# EAGLE design Dual Vertical Breakout Module (EAGLE 6.1)
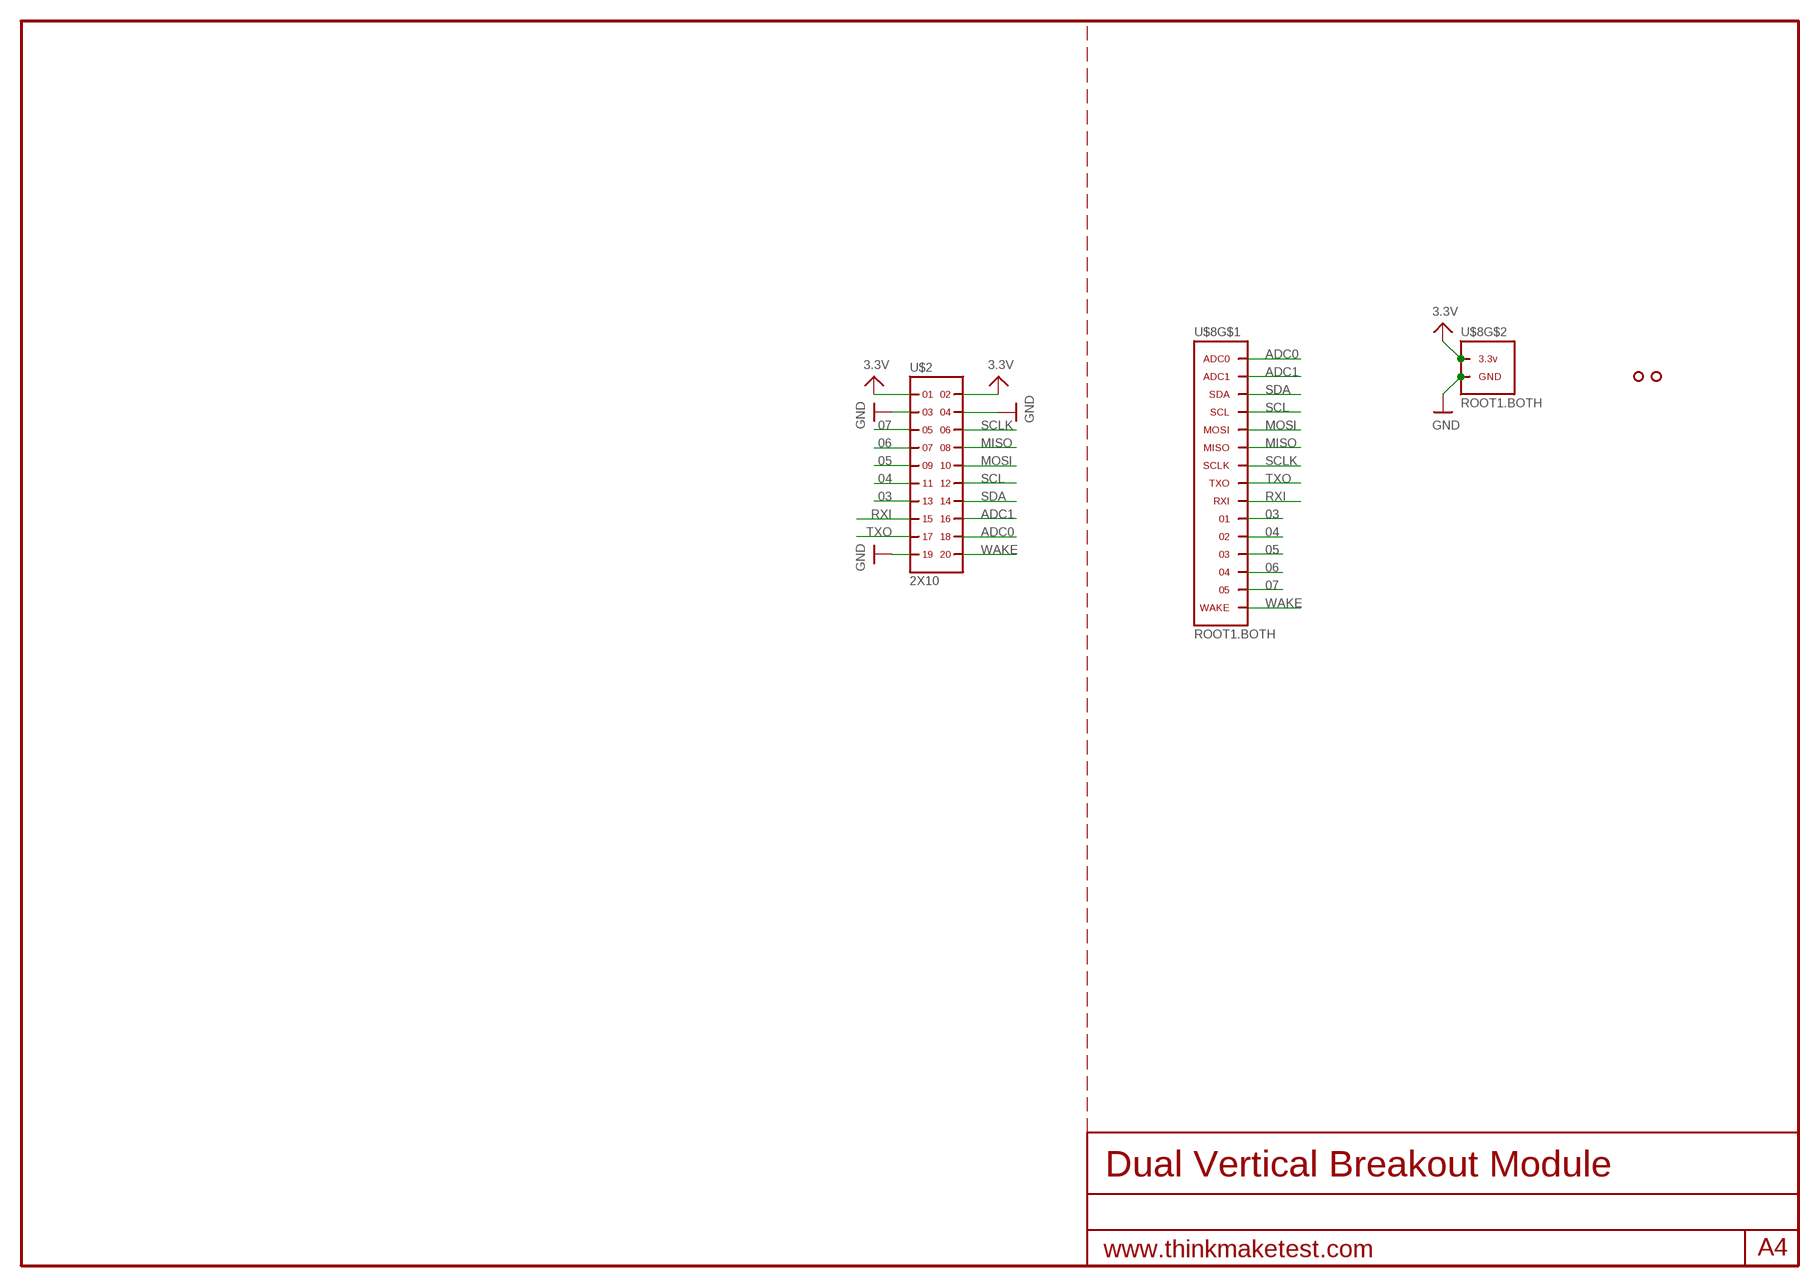
[diagram p0: schematic, sheet 1]

## Parts
U$2  2X10  [2X10]
U$3  HOLE.2MM  [2MM]
U$4  HOLE.2MM  [2MM]
U$8  ROOT1.BOTH  [ROOT1.BOTH]

## Nets
03: U$2.13 U$8.03 U$8.03@1 U$8.03@VIA
3.3V: U$2.1 U$2.2 U$8.3.3V@1(3.3V) U$8.3.3V@2(3.3V) U$8.3.3V@3(3.3V) U$8.3.3V@4(3.3V) U$8.3.3V@5(3.3V) U$8.3.3V@6(3.3V) U$8.3.3V@7(3.3V) U$8.3.3V@8(3.3V) U$8.3.3V@9(3.3V) U$8.3.3V@10(3.3V) U$8.3.3V@VIA(3.3V)
04: U$2.11 U$8.04 U$8.04@1 U$8.04@VIA
05: U$2.9 U$8.05 U$8.05@1 U$8.05@VIA
06: U$2.7 U$8.06 U$8.06@1 U$8.06@VIA
07: U$2.5 U$8.07 U$8.07@1 U$8.07@VIA
ADC0: U$2.18 U$8.ADC0 U$8.ADC0@1(ADC0) U$8.ADC0@VIA(ADC0)
ADC1: U$2.16 U$8.ADC1 U$8.ADC1@1(ADC1) U$8.ADC1@VIA(ADC1)
GND: U$2.3 U$2.4 U$2.19 U$8.GND@1(GND) U$8.GND@2(GND) U$8.GND@3(GND) U$8.GND@4(GND) U$8.GND@5(GND) U$8.GND@6(GND) U$8.GND@7(GND) U$8.GND@8(GND) U$8.GND@9(GND) U$8.GND@10(GND) U$8.GND@11(GND) U$8.GND@12(GND) U$8.GND@13(GND) U$8.GND@14(GND) U$8.GND@15(GND) U$8.GND@16(GND) U$8.GND@17(GND) U$8.GND@18(GND) U$8.GND@19(GND) U$8.GND@20(GND) U$8.GND@VIA(GND)
MISO: U$2.8 U$8.MISO U$8.MISO@1(MISO) U$8.MISO@VIA(MISO)
MOSI: U$2.10 U$8.MOSI U$8.MOSI@1(MOSI) U$8.MOSI@VIA(MOSI)
RXI: U$2.15 U$8.02(RXI) U$8.02@1(RXI) U$8.02@VIA(RXI)
SCL: U$2.12 U$8.SCL U$8.SCL@1(SCL) U$8.SCL@VIA(SCL)
SCLK: U$2.6 U$8.SCLK U$8.SCLK@1(SCLK) U$8.SCLK@VIA(SCLK)
SDA: U$2.14 U$8.SDA U$8.SDA@1(SDA) U$8.SDA@VIA(SDA)
TXO: U$2.17 U$8.01(TXO) U$8.01@1(TXO) U$8.01@VIA(TXO)
WAKE: U$2.20 U$8.WAKE U$8.WAKE@1(WAKE) U$8.WAKE@VIA(WAKE)

## Library data of the parts
U$2 = .headers(.1in):2X10
U$3 U$4 = .screw_holes:HOLE
U$8 = thinkmaketest:ROOT1

## Board
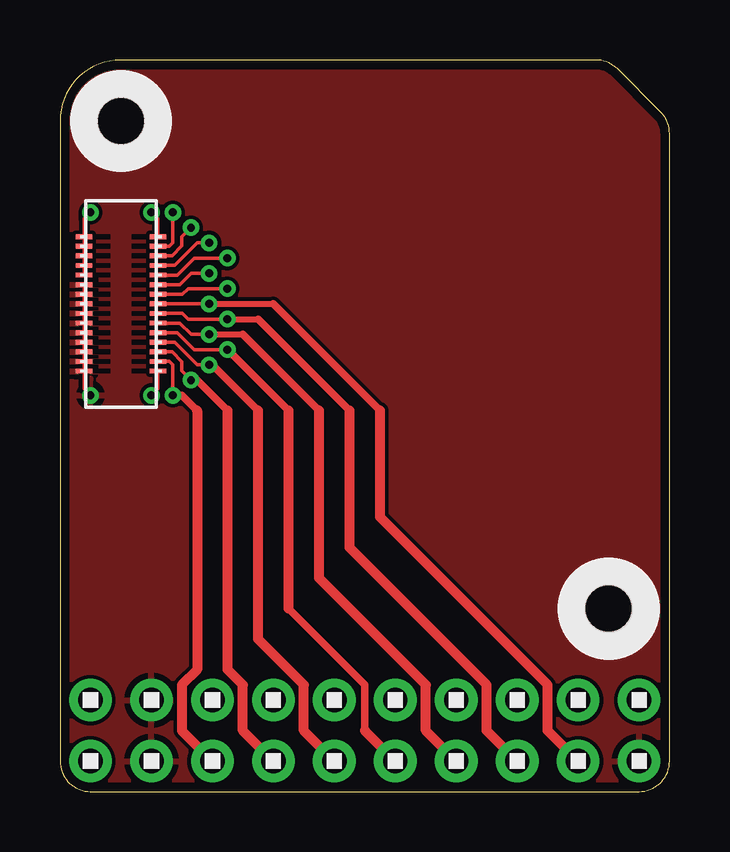
[diagram p1: board, top side]
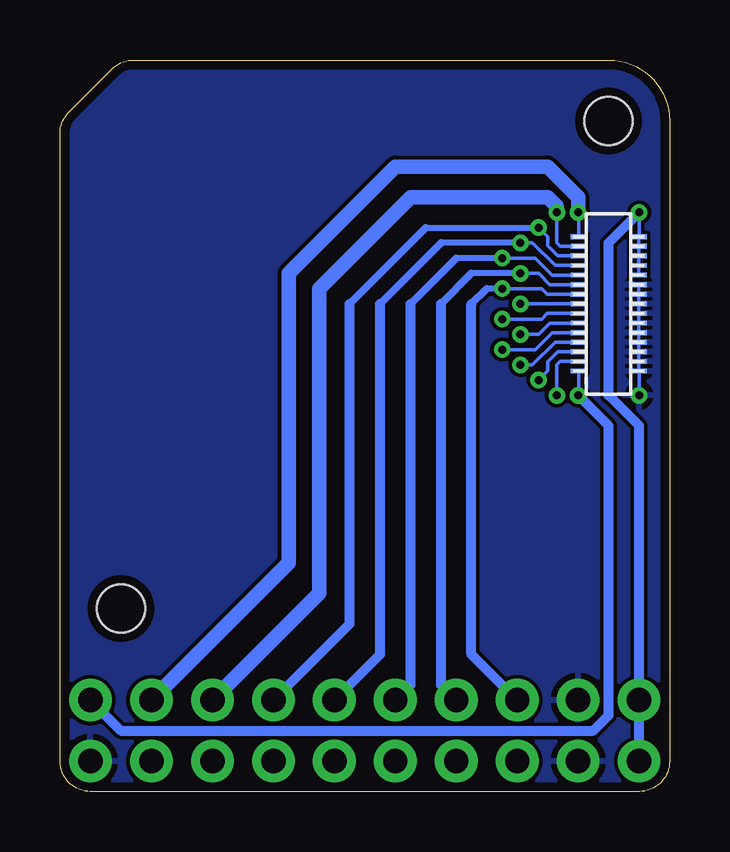
[diagram p2: board, bottom side, seen from below]

Size 25.4 x 30.48 mm. Coordinates in mm from the lower left corner, seen from the top.
Outline: 0,27.94 0,1.27 arc90 1.27,0 24.13,0 arc90 25.4,1.27 25.4,27.41 arc45 25.03,28.31 23.23,30.11 arc45 22.33,30.48 2.54,30.48 arc90 0,27.94
Copper layers (1*16): Top 0.0356mm / dielectric 1.5011mm / Bottom 0.0356mm
Design rules: minimum track width 6mil, minimum drill 13mil, track to track 6mil, track to pad 6mil, pad to pad 6mil, via to via 6mil, smd to smd 6mil, copper to edge 15mil, drill to drill 6mil, minimum pad ring 7mil, minimum via ring 7mil, stop-mask expansion 4mil, vias tented up to drill 16mil, thermal gap 10mil

### Footprints (pad centres in the part's own frame; a part is rotated, then mirrored left to right if it is on the bottom)
2X10 = drill 1.016 pad 1.778: 1 0,0; 2 0,2.54; 3 2.54,0; 4 2.54,2.54; 5 5.08,0; 6 5.08,2.54; 7 7.62,0; 8 7.62,2.54; 9 10.16,0; 10 10.16,2.54; 11 12.7,0; 12 12.7,2.54; 13 15.24,0; 14 15.24,2.54; 15 17.78,0; 16 17.78,2.54; 17 20.32,0; 18 20.32,2.54; 19 22.86,0; 20 22.86,2.54
2MM = hole 2: 0,0
ROOT1.BOTH = smd 0.7 x 0.2: 01 4.08,15.24; 02 4.08,14.84; 03 4.08,14.44; 3.3V@1 1,18.04; 3.3V@2 1,17.64; 3.3V@3 1,17.24; 3.3V@4 1,16.84; 3.3V@5 1,16.44; 04 4.08,14.04; 05 4.08,13.64; 06 4.08,13.24; 07 4.08,12.84; ADC0 4.08,18.04; ADC1 4.08,17.64; GND@1 1,16.04; GND@2 1,15.64; GND@3 1,15.24; GND@4 1,14.84; GND@5 1,14.44; GND@6 1,14.04; GND@7 1,13.64; GND@8 1,13.24; GND@9 1,12.84; GND@10 1,12.44; MISO 4.08,16.04; MOSI 4.08,16.44; SCL 4.08,16.84; SCLK 4.08,15.64; SDA 4.08,17.24; WAKE 4.08,12.44 | smd 0.66 x 0.2 bottom: 01@1 3.795,15.24; 02@1 3.795,14.84; 3.3V@6 1.285,16.44; 3.3V@7 1.285,16.84; 3.3V@8 1.285,17.24; 3.3V@9 1.285,17.64; 3.3V@10 1.285,18.04; 03@1 3.795,14.44; 04@1 3.795,14.04; 05@1 3.795,13.64; 06@1 3.795,13.24; 07@1 3.795,12.84; ADC0@1 3.795,18.04; ADC1@1 3.795,17.64; GND@11 1.285,12.44; GND@12 1.285,12.84; GND@13 1.285,13.24; GND@14 1.285,13.64; GND@15 1.285,14.04; GND@16 1.285,14.44; GND@17 1.285,14.84; GND@18 1.285,15.24; GND@19 1.285,15.64; GND@20 1.285,16.04; MISO@1 3.795,16.04; MOSI@1 3.795,16.44; SCL@1 3.795,16.84; SCLK@1 3.795,15.64; SDA@1 3.795,17.24; WAKE@1 3.795,12.44 | drill 0.33 pad 0.686: 01@VIA 6.215,15.24; 02@VIA 6.973,14.605; 3.3V@VIA 1.27,19.05; 03@VIA 6.215,13.97; 04@VIA 6.973,13.335; 05@VIA 6.215,12.7; 06@VIA 5.457,12.065; 07@VIA 4.699,11.43; ADC0@VIA 3.81,19.05; ADC1@VIA 4.699,19.05; GND@VIA 1.27,11.43; MISO@VIA 6.215,16.51; MOSI@VIA 6.973,17.145; SCL@VIA 6.215,17.78; SCLK@VIA 6.973,15.875; SDA@VIA 5.457,18.415; WAKE@VIA 3.81,11.43

### Placement (x,y rotation side)
U$2  1.27,1.27 0 top
U$3  22.86,7.62 90 top
U$4  2.54,27.94 90 top
U$8  0,5.08 0 top

### Tracks (layer width: path | path; a pad name or v marks a point on that pad's centre or on a via)
03
  Top 0.254: U$8.03@VIA 7.62,19.05
  Top 0.305: 7.62,19.05 10.79,15.88
  Top 0.406: U$2.13 15.24,2.54 15.24,4.45 10.79,8.89 10.79,15.88
3.3V
  Bottom 0.406: U$2.1 U$2.2 1.27,15.24 2.54,16.51 2.54,22.86 U$8.3.3V@VIA
04
  Top 0.305: 12.7,2.54 12.7,4.45 9.53,7.62 | U$8.04@VIA 6.99,18.41 9.53,15.88
  Top 0.406: U$2.11 12.7,2.54 | 9.53,7.62 9.53,15.88
05
  Top 0.305: U$8.05@VIA 6.35,17.78 8.26,15.88
  Top 0.406: U$2.9 10.16,2.54 10.16,4.45 8.26,6.35 8.26,15.88
06
  Top 0.305: U$8.06@VIA 5.71,17.14 6.99,15.88
  Top 0.406: U$2.7 7.62,2.54 7.62,4.45 6.99,5.08 6.99,15.88
07
  Top 0.305: U$8.07@VIA 5.08,16.51 5.71,15.88
  Top 0.406: U$2.5 5.08,2.54 5.08,4.45 5.71,5.08 5.71,15.88
ADC0
  Bottom 0.61: U$2.18 15.88,9.53 15.88,21.59 11.43,26.04 5.08,26.04 3.81,24.77 U$8.ADC0@VIA
ADC1
  Bottom 0.406: 4.7,24.38 U$8.ADC1@VIA
  Bottom 0.61: U$2.16 14.61,8.26 14.61,20.95 10.79,24.77 5.08,24.77 4.7,24.38
GND
  pour Bottom: 0,0 25.4,0 25.4,30.48 0,30.48
  pour Top: 0,0 25.4,0 25.4,30.48 0,30.48
MISO
  Bottom 0.254: U$8.MISO@VIA 8.26,21.59
  Bottom 0.305: 8.26,21.59 9.53,20.32
  Bottom 0.406: U$2.8 9.53,4.45 9.53,20.32
MOSI
  Bottom 0.254: U$8.MOSI@VIA 8.89,22.23
  Bottom 0.305: 8.89,22.23 10.79,20.32
  Bottom 0.406: U$2.10 10.79,4.45 10.79,20.32
RXI
  Top 0.254: U$8.02@VIA 8.26,19.68
  Top 0.305: 8.26,19.68 12.06,15.88
  Top 0.406: U$2.15 17.78,2.54 17.78,4.45 12.06,10.16 12.06,15.88
SCL
  Bottom 0.254: U$8.SCL@VIA 9.53,22.86
  Bottom 0.305: 9.53,22.86 12.06,20.32
  Bottom 0.406: U$2.12 12.06,5.71 12.06,20.32
SCLK
  Bottom 0.254: U$8.SCLK@VIA 7.62,20.95
  Bottom 0.305: 7.62,20.95 8.26,20.32
  Bottom 0.406: U$2.6 8.26,5.71 8.26,20.32
SDA
  Bottom 0.254: 10.16,23.5 U$8.SDA@VIA
  Bottom 0.305: 10.16,23.5 13.34,20.32
  Bottom 0.406: U$2.14 13.34,6.99 13.34,20.32
TXO
  Top 0.254: U$8.01@VIA 8.89,20.32
  Top 0.305: 8.89,20.32 13.34,15.88
  Top 0.406: U$2.17 20.32,2.54 20.32,4.45 13.34,11.43 13.34,15.88
WAKE
  Bottom 0.406: U$2.20 22.86,2.54 3.17,2.54 2.54,3.17 2.54,15.24 U$8.WAKE@VIA